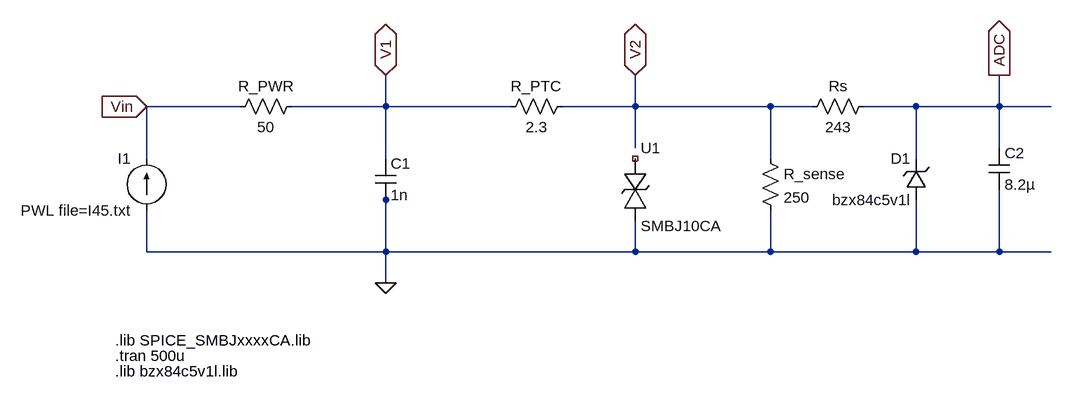
[diagram p0: schematic tvs_test1.asc]
tvs_test1.asc, the LTspice schematic file:
Version 4
SHEET 1 1840 900
WIRE -224 -32 -368 -32
WIRE 0 -32 0 -80
WIRE 0 -32 -144 -32
WIRE 192 -32 0 -32
WIRE 384 -32 384 -80
WIRE 384 -32 272 -32
WIRE 592 -32 384 -32
WIRE 656 -32 592 -32
WIRE 816 -32 736 -32
WIRE 944 -32 944 -80
WIRE 944 -32 816 -32
WIRE 1024 -32 944 -32
WIRE 384 32 384 -32
WIRE 944 32 944 -32
WIRE -368 48 -368 -32
WIRE 0 48 0 -32
WIRE 592 48 592 -32
WIRE 816 48 816 -32
WIRE 0 112 0 96
WIRE -368 192 -368 128
WIRE 0 192 0 112
WIRE 0 192 -368 192
WIRE 384 192 384 144
WIRE 384 192 0 192
WIRE 592 192 592 128
WIRE 592 192 384 192
WIRE 816 192 816 112
WIRE 816 192 592 192
WIRE 944 192 944 96
WIRE 944 192 816 192
WIRE 1024 192 944 192
WIRE 0 240 0 192
FLAG 0 -80 V1
IOPIN 0 -80 BiDir
FLAG 384 -80 V2
IOPIN 384 -80 BiDir
FLAG 0 240 0
FLAG 944 -80 ADC
IOPIN 944 -80 Out
FLAG -368 -32 Vin
IOPIN -368 -32 In
SYMBOL tvs_bipolar_diode 368 80 R0
WINDOW 0 24 -48 Left 2
WINDOW 3 24 72 Left 2
SYMATTR InstName U1
SYMATTR Value SMBJ10CA
SYMBOL cap 928 32 R0
SYMATTR InstName C2
SYMATTR Value 8.2µ
SYMBOL zener 832 112 R180
WINDOW 0 24 64 Left 2
WINDOW 3 24 0 Left 2
SYMATTR InstName D1
SYMATTR Value bzx84c5v1l
SYMATTR Prefix X
SYMBOL cap -16 48 R0
SYMATTR InstName C1
SYMATTR Value 1n
SYMBOL res 640 -16 R270
WINDOW 0 32 56 VTop 2
WINDOW 3 0 56 VBottom 2
SYMATTR InstName Rs
SYMATTR Value 243
SYMBOL res -240 -16 R270
WINDOW 0 32 56 VTop 2
WINDOW 3 0 56 VBottom 2
SYMATTR InstName R_PWR
SYMATTR Value 50
SYMBOL res 176 -16 R270
WINDOW 0 32 56 VTop 2
WINDOW 3 0 56 VBottom 2
SYMATTR InstName R_PTC
SYMATTR Value 2.3
SYMBOL res 576 32 R0
SYMATTR InstName R_sense
SYMATTR Value 250
SYMBOL current -368 128 R180
WINDOW 0 24 80 Left 2
WINDOW 3 24 0 Left 2
WINDOW 123 0 0 Left 0
WINDOW 39 0 0 Left 0
SYMATTR InstName I1
SYMATTR Value PWL file=I45.txt
TEXT -416 328 Left 2 !.lib SPICE_SMBJxxxxCA.lib
TEXT -416 352 Left 2 !.tran 500u
TEXT -416 376 Left 2 !.lib bzx84c5v1l.lib

The netlist it stands for:
* tvs_test1.asc
XU1 NC_01 0 SMBJ10CA  ; pins + -
C2 ADC 0 8.2µ
XD1 0 ADC bzx84c5v1l  ; pins + -
C1 V1 0 1n
Rs V2 ADC 243
R_PWR Vin V1 50
R_PTC V1 V2 2.3
R_sense V2 0 250
I1 0 Vin PWL file=I45.txt
.lib SPICE_SMBJxxxxCA.lib
.tran 500u
.lib bzx84c5v1l.lib
.backanno
.end